# Altium schematic sheet LCD.SchDoc
size B
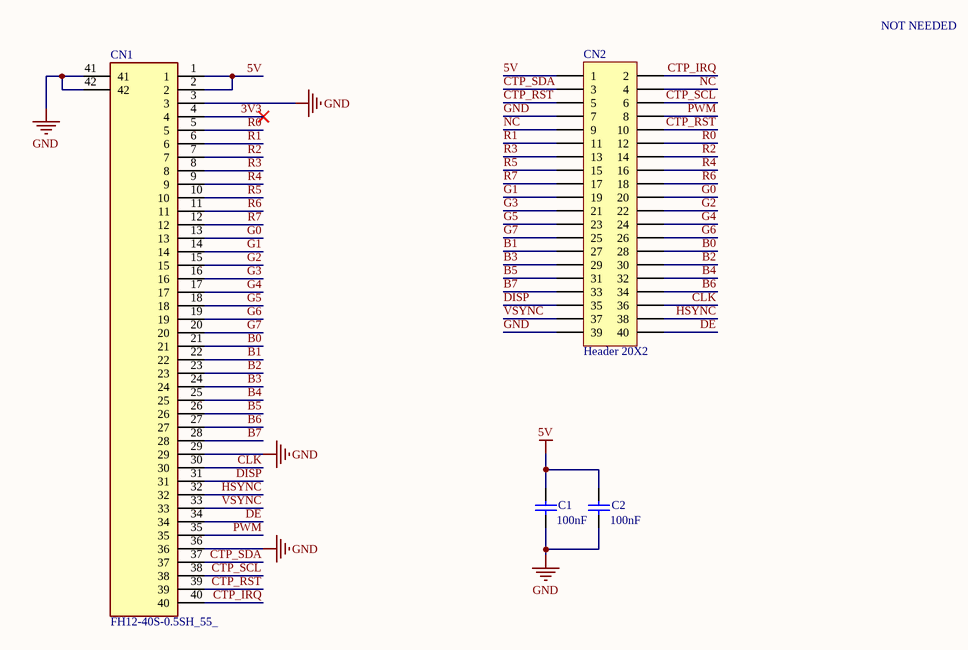
[diagram p0: LCD.SchDoc]

## Parts
C1  value 100nF  [RAD-0.3]  (hidden comment: X5R)
C2  value 100nF  [RAD-0.3]  (hidden comment: X5R)
CN1  FH12-40S-0.5SH_55_  [FH1240S05SH55]
CN2  Header 20X2  [HDR2X20]

## Nets
5V: C1.1 C2.1 CN1.1 CN1.2 CN2.1
GND: C1.2 C2.2 CN1.3 CN1.29 CN1.36 CN1.41 CN1.42 CN2.7 CN2.39
3V3: CN1.4
B0: CN1.21 CN2.28
B1: CN1.22 CN2.27
B2: CN1.23 CN2.30
B3: CN1.24 CN2.29
B4: CN1.25 CN2.32
B5: CN1.26 CN2.31
B6: CN1.27 CN2.34
B7: CN1.28 CN2.33
CLK: CN1.30 CN2.36
CTP_IRQ: CN1.40 CN2.2
CTP_RST: CN1.39 CN2.5 CN2.10
CTP_SCL: CN1.38 CN2.6
CTP_SDA: CN1.37 CN2.3
DE: CN1.34 CN2.40
DISP: CN1.31 CN2.35
G0: CN1.13 CN2.20
G1: CN1.14 CN2.19
G2: CN1.15 CN2.22
G3: CN1.16 CN2.21
G4: CN1.17 CN2.24
G5: CN1.18 CN2.23
G6: CN1.19 CN2.26
G7: CN1.20 CN2.25
HSYNC: CN1.32 CN2.38
NC: CN2.4 CN2.9
PWM: CN1.35 CN2.8
R0: CN1.5 CN2.12
R1: CN1.6 CN2.11
R2: CN1.7 CN2.14
R3: CN1.8 CN2.13
R4: CN1.9 CN2.16
R5: CN1.10 CN2.15
R6: CN1.11 CN2.18
R7: CN1.12 CN2.17
VSYNC: CN1.33 CN2.37

## Notes on the sheet
- NOT NEEDED

## Library data of the parts
C1 C2 = Cap: Capacitor; Published: 8-Jun-2000; LatestRevisionDate: 17-Jul-2002; LatestRevisionNote: Re-released for DXP Platform.; PackageReference: RAD-0.3; Publisher: Altium Limited; PackageDescription: Radial Cap, Thru-Hole; 2 Leads; 0.3 in Pin Spacing
CN1 = FH12-40S-0.5SH_55_: Connector; Manufacturer_Name: Hirose; Manufacturer_Part_Number: FH12-40S-0.5SH(55); Datasheet Link: https://datasheet.datasheetarchive.com/originals/distributors/SFDatasheet-1/sf-00023459.pdf; Height: 2mm; Mouser Part Number: 798-FH12-40S-0.5SH55; Mouser Price/Stock: https://www.mouser.co.uk/ProductDetail/Hirose-Connector/FH12-40S-0.5SH55?qs=Ux3WWAnHpjCB5TtHwQqTgA%3D%3D; Arrow Part Number: FH12-40S-0.5SH(55); Arrow Price/Stock: https://www.arrow.com/en/products/fh12-40s-0.5sh-55/hirose-electric
CN2 = Header 20X2: Header, 20-Pin, Dual row; LatestRevisionDate: 17-Jul-2002; LatestRevisionNote: Re-released for DXP Platform.; Publisher: Altium Limited